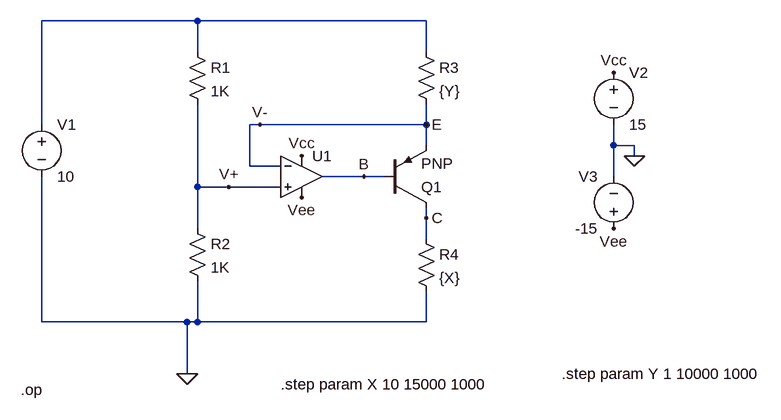
[diagram p0: schematic source_courant.asc]
source_courant.asc, the LTspice schematic file:
Version 4
SHEET 1 944 680
WIRE 32 -96 -208 -96
WIRE 384 -96 32 -96
WIRE 32 -48 32 -96
WIRE 384 -48 384 -96
WIRE -208 64 -208 -96
WIRE 128 64 112 64
WIRE 384 64 384 32
WIRE 384 64 128 64
WIRE 384 96 384 64
WIRE 672 96 672 64
WIRE 704 96 672 96
WIRE 704 112 704 96
WIRE 112 128 112 64
WIRE 160 128 112 128
WIRE 288 144 224 144
WIRE 320 144 288 144
WIRE 672 144 672 96
WIRE 32 160 32 32
WIRE 80 160 32 160
WIRE 160 160 80 160
WIRE 384 208 384 192
WIRE 32 224 32 160
WIRE 384 240 384 208
WIRE -208 368 -208 144
WIRE 16 368 -208 368
WIRE 32 368 32 304
WIRE 32 368 16 368
WIRE 384 368 384 320
WIRE 384 368 32 368
WIRE 16 448 16 368
FLAG 16 448 0
FLAG 672 -16 Vcc
FLAG 672 224 Vee
FLAG 704 112 0
FLAG 192 112 Vcc
FLAG 192 176 Vee
FLAG 80 160 V+
FLAG 128 64 V-
FLAG 288 144 B
FLAG 384 208 C
FLAG 384 64 E
SYMBOL Opamps\\UniversalOpamp2 192 144 R0
SYMATTR InstName U1
SYMBOL res 16 -64 R0
SYMATTR InstName R1
SYMATTR Value 1K
SYMBOL res 16 208 R0
SYMATTR InstName R2
SYMATTR Value 1K
SYMBOL res 368 -64 R0
SYMATTR InstName R3
SYMATTR Value {Y}
SYMBOL res 368 224 R0
SYMATTR InstName R4
SYMATTR Value {X}
SYMBOL pnp 320 192 M180
SYMATTR InstName Q1
SYMBOL voltage -208 48 R0
WINDOW 123 0 0 Left 2
WINDOW 39 0 0 Left 2
SYMATTR InstName V1
SYMATTR Value 10
SYMBOL voltage 672 -32 R0
WINDOW 123 0 0 Left 2
WINDOW 39 0 0 Left 2
SYMATTR InstName V2
SYMATTR Value 15
SYMBOL voltage 672 240 R180
WINDOW 0 24 96 Left 2
WINDOW 3 24 16 Left 2
WINDOW 123 0 0 Left 2
WINDOW 39 0 0 Left 2
SYMATTR InstName V3
SYMATTR Value -15
TEXT -240 472 Left 2 !.op
TEXT 160 464 Left 2 !.step param X 10 15000 1000
TEXT 592 448 Left 2 !.step param Y 1 10000 1000

The netlist it stands for:
* source_courant.asc
XU1 V+ E Vcc Vee B level.2 Avol=1Meg GBW=10Meg Slew=10Meg ilimit=25m rail=0 Vos=0 phimargin=45 en=0 enk=0 in=0 ink=0 Rin=500Meg  ; pins IN+ IN- V+ V- OUT
R1 N001 V+ 1K
R2 V+ 0 1K
R3 N001 E {Y}
R4 C 0 {X}
Q1 C B E 0 PNP
V1 N001 0 10
V2 Vcc 0 15
V3 Vee 0 -15
.model NPN NPN
.model PNP PNP
.lib standard.bjt
.op
.step param X 10 15000 1000
.step param Y 1 10000 1000
.lib UniversalOpamps2.sub
.backanno
.end

* Results of the author's LTspice run, read from the files saved beside the schematic
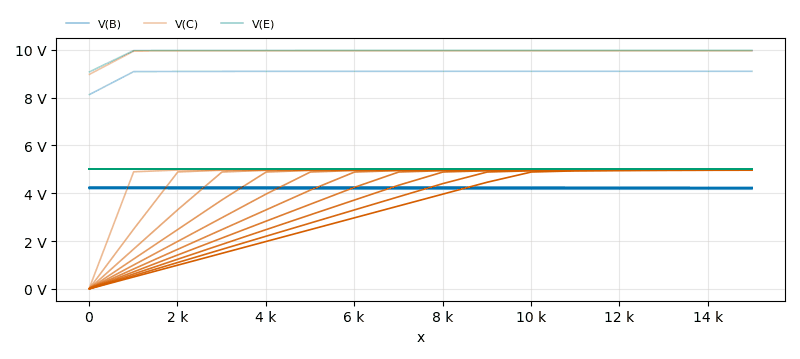
[diagram p1: Operating Point of source_courant.asc, plotted from the saved traces]
* Operating Point, 11 runs:
*   V(B) [y=1]: 8.127 V at x=10 , 9.099 V at x=15 k, min 8.127 V, max 9.099 V
*   V(B) [y=1001]: 4.184 V at x=10 , 4.168 V at x=15 k, min 4.168 V, max 4.184 V
*   V(B) [y=2001]: 4.202 V at x=10 , 4.186 V at x=15 k, min 4.186 V, max 4.202 V
*   V(B) [y=3001]: 4.213 V at x=10 , 4.198 V at x=15 k, min 4.198 V, max 4.213 V
*   V(B) [y=4001]: 4.22 V at x=10 , 4.206 V at x=15 k, min 4.206 V, max 4.22 V
*   V(B) [y=5001]: 4.226 V at x=10 , 4.213 V at x=15 k, min 4.213 V, max 4.226 V
*   V(B) [y=6001]: 4.231 V at x=10 , 4.219 V at x=15 k, min 4.219 V, max 4.231 V
*   V(B) [y=7001]: 4.235 V at x=10 , 4.224 V at x=15 k, min 4.224 V, max 4.235 V
*   V(C) [y=1]: 8.972 V at x=10 , 9.956 V at x=15 k, min 8.972 V, max 9.956 V
*   V(C) [y=1001]: 49.46 mV at x=10 , 4.981 V at x=15 k, min 49.46 mV, max 4.981 V
*   V(C) [y=2001]: 24.74 mV at x=10 , 4.98 V at x=15 k, min 24.74 mV, max 4.98 V
*   V(C) [y=3001]: 16.5 mV at x=10 , 4.979 V at x=15 k, min 16.5 mV, max 4.979 V
*   V(C) [y=4001]: 12.37 mV at x=10 , 4.978 V at x=15 k, min 12.37 mV, max 4.978 V
*   V(C) [y=5001]: 9.899 mV at x=10 , 4.976 V at x=15 k, min 9.899 mV, max 4.976 V
*   V(C) [y=6001]: 8.249 mV at x=10 , 4.975 V at x=15 k, min 8.249 mV, max 4.975 V
*   V(C) [y=7001]: 7.071 mV at x=10 , 4.973 V at x=15 k, min 7.071 mV, max 4.973 V
*   V(E) [y=1]: 9.078 V at x=10 , 9.974 V at x=15 k, min 9.078 V, max 9.974 V
*   V(E) [y=1001]: 5 V at x=10 , 5 V at x=15 k, min 5 V, max 5 V
*   V(E) [y=2001]: 5 V at x=10 , 5 V at x=15 k, min 5 V, max 5 V
*   V(E) [y=3001]: 5 V at x=10 , 5 V at x=15 k, min 5 V, max 5 V
*   V(E) [y=4001]: 5 V at x=10 , 5 V at x=15 k, min 5 V, max 5 V
*   V(E) [y=5001]: 5 V at x=10 , 5 V at x=15 k, min 5 V, max 5 V
*   V(E) [y=6001]: 5 V at x=10 , 5 V at x=15 k, min 5 V, max 5 V
*   V(E) [y=7001]: 5 V at x=10 , 5 V at x=15 k, min 5 V, max 5 V
* From the log:
*   Semiconductor Device Operating Points:
*                           --- Bipolar Transistors ---
*   Name:       q1
*   Model:      pnp
*   Ib:      -2.50e-02
*   Ic:      -8.97e-01
*   Vbe:     -9.51e-01
*   Vbc:     -8.45e-01
*   Vce:     -1.06e-01
*   BetaDC:   3.59e+01
*   Gm:       3.53e+01
*   Rpi:      2.79e+00
*   Rx:       0.00e+00
*   Ro:       1.65e+00
*   Cbe:      0.00e+00
*   Cbc:      0.00e+00
*   Cjs:      0.00e+00
*   BetaAC:   9.83e+01
*   Cbx:      0.00e+00
*   Ft:       0.00e+00